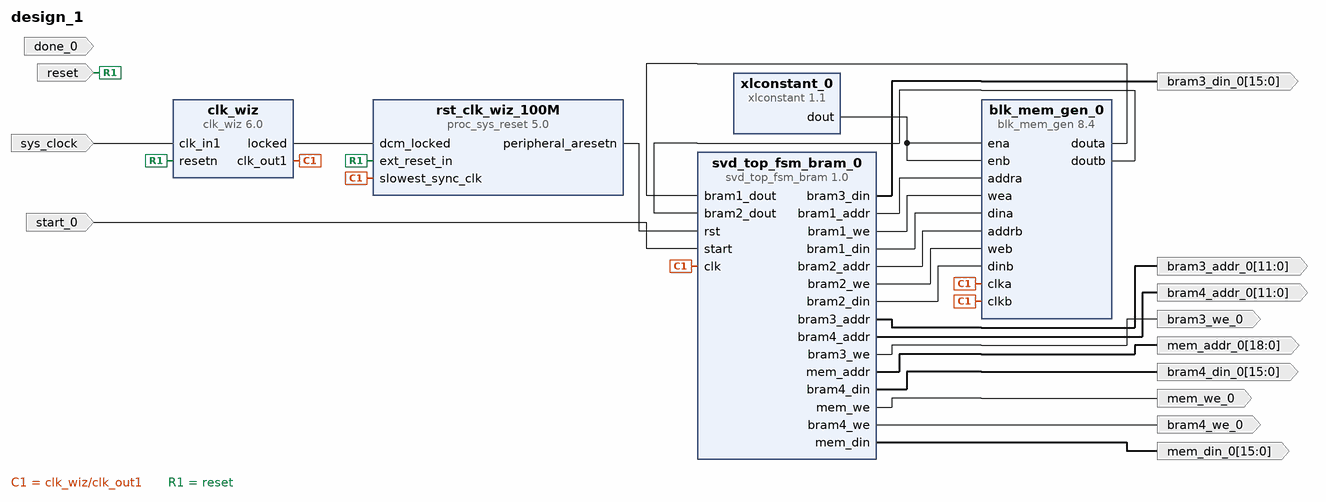
[diagram p0: block diagram of the top level]
# Vivado block design design_1, xc7a100tcsg324-1, Vivado 2018.3.1
create_bd_design design_1

create_bd_port -dir I -type rst reset
set_property -dict {CONFIG.POLARITY ACTIVE_LOW} [get_bd_ports reset]
create_bd_port -dir I -type clk sys_clock
set_property -dict {CONFIG.FREQ_HZ 100000000 CONFIG.PHASE 0.000} [get_bd_ports sys_clock]
create_bd_port -dir I start_0
create_bd_port -dir I done_0
create_bd_port -dir O -from 15 -to 0 bram3_din_0
create_bd_port -dir O mem_we_0
create_bd_port -dir O -from 18 -to 0 mem_addr_0
create_bd_port -dir O -from 11 -to 0 bram4_addr_0
create_bd_port -dir O bram4_we_0
create_bd_port -dir O -from 15 -to 0 bram4_din_0
create_bd_port -dir O -from 11 -to 0 bram3_addr_0
create_bd_port -dir O bram3_we_0
create_bd_port -dir O -from 15 -to 0 mem_din_0

create_bd_cell -type ip -vlnv xilinx.com:ip:blk_mem_gen:8.4 blk_mem_gen_0
set_property -dict [list \
  CONFIG.Assume_Synchronous_Clk true \
  CONFIG.Enable_32bit_Address false \
  CONFIG.Enable_B Use_ENB_Pin \
  CONFIG.Memory_Type True_Dual_Port_RAM \
  CONFIG.Port_B_Clock 100 \
  CONFIG.Port_B_Enable_Rate 100 \
  CONFIG.Port_B_Write_Rate 50 \
  CONFIG.Register_PortA_Output_of_Memory_Primitives true \
  CONFIG.Register_PortB_Output_of_Memory_Primitives true \
  CONFIG.Use_Byte_Write_Enable false \
  CONFIG.Use_RSTA_Pin false \
  CONFIG.use_bram_block Stand_Alone \
] [get_bd_cells blk_mem_gen_0]
create_bd_cell -type ip -vlnv xilinx.com:ip:xlconstant:1.1 xlconstant_0
create_bd_cell -type ip -vlnv xilinx.com:ip:clk_wiz:6.0 clk_wiz
set_property -dict [list \
  CONFIG.CLK_IN1_BOARD_INTERFACE sys_clock \
  CONFIG.RESET_BOARD_INTERFACE reset \
  CONFIG.RESET_PORT resetn \
  CONFIG.RESET_TYPE ACTIVE_LOW \
  CONFIG.USE_BOARD_FLOW true \
] [get_bd_cells clk_wiz]
create_bd_cell -type ip -vlnv xilinx.com:ip:proc_sys_reset:5.0 rst_clk_wiz_100M
set_property -dict {CONFIG.RESET_BOARD_INTERFACE reset CONFIG.USE_BOARD_FLOW true} [get_bd_cells rst_clk_wiz_100M]
create_bd_cell -type ip -vlnv xilinx.com:user:svd_top_fsm_bram:1.0 svd_top_fsm_bram_0

# ---- connections ----

connect_bd_net [get_bd_pins svd_top_fsm_bram_0/bram1_addr] [get_bd_pins blk_mem_gen_0/addra]
connect_bd_net [get_bd_pins svd_top_fsm_bram_0/bram1_we] [get_bd_pins blk_mem_gen_0/wea]
connect_bd_net [get_bd_pins svd_top_fsm_bram_0/bram1_din] [get_bd_pins blk_mem_gen_0/dina]
connect_bd_net [get_bd_pins blk_mem_gen_0/douta] [get_bd_pins svd_top_fsm_bram_0/bram1_dout]
connect_bd_net [get_bd_pins clk_wiz/clk_out1] \
  [get_bd_pins blk_mem_gen_0/clka] [get_bd_pins blk_mem_gen_0/clkb] [get_bd_pins rst_clk_wiz_100M/slowest_sync_clk] \
  [get_bd_pins svd_top_fsm_bram_0/clk]
connect_bd_net [get_bd_pins svd_top_fsm_bram_0/bram2_addr] [get_bd_pins blk_mem_gen_0/addrb]
connect_bd_net [get_bd_pins svd_top_fsm_bram_0/bram2_we] [get_bd_pins blk_mem_gen_0/web]
connect_bd_net [get_bd_pins svd_top_fsm_bram_0/bram2_din] [get_bd_pins blk_mem_gen_0/dinb]
connect_bd_net [get_bd_pins blk_mem_gen_0/doutb] [get_bd_pins svd_top_fsm_bram_0/bram2_dout]
connect_bd_net [get_bd_pins xlconstant_0/dout] [get_bd_pins blk_mem_gen_0/ena] [get_bd_pins blk_mem_gen_0/enb]
connect_bd_net [get_bd_pins clk_wiz/locked] [get_bd_pins rst_clk_wiz_100M/dcm_locked]
connect_bd_net [get_bd_pins rst_clk_wiz_100M/peripheral_aresetn] [get_bd_pins svd_top_fsm_bram_0/rst]
connect_bd_net [get_bd_ports reset] [get_bd_pins rst_clk_wiz_100M/ext_reset_in] [get_bd_pins clk_wiz/resetn]
connect_bd_net [get_bd_ports sys_clock] [get_bd_pins clk_wiz/clk_in1]
connect_bd_net -net start_0_1 [get_bd_ports start_0] [get_bd_pins svd_top_fsm_bram_0/start]
# net done_0_1 has one end: done_0
connect_bd_net [get_bd_pins svd_top_fsm_bram_0/bram3_din] [get_bd_ports bram3_din_0]
connect_bd_net [get_bd_pins svd_top_fsm_bram_0/mem_we] [get_bd_ports mem_we_0]
connect_bd_net [get_bd_pins svd_top_fsm_bram_0/mem_addr] [get_bd_ports mem_addr_0]
connect_bd_net [get_bd_pins svd_top_fsm_bram_0/bram4_addr] [get_bd_ports bram4_addr_0]
connect_bd_net [get_bd_pins svd_top_fsm_bram_0/bram4_we] [get_bd_ports bram4_we_0]
connect_bd_net [get_bd_pins svd_top_fsm_bram_0/bram4_din] [get_bd_ports bram4_din_0]
connect_bd_net [get_bd_pins svd_top_fsm_bram_0/bram3_addr] [get_bd_ports bram3_addr_0]
connect_bd_net [get_bd_pins svd_top_fsm_bram_0/bram3_we] [get_bd_ports bram3_we_0]
connect_bd_net [get_bd_pins svd_top_fsm_bram_0/mem_din] [get_bd_ports mem_din_0]

validate_bd_design
save_bd_design
